# EAGLE schematic mcat-4cu-b-v2d (EAGLE 6.5.0)

## Sheet 1 of 5
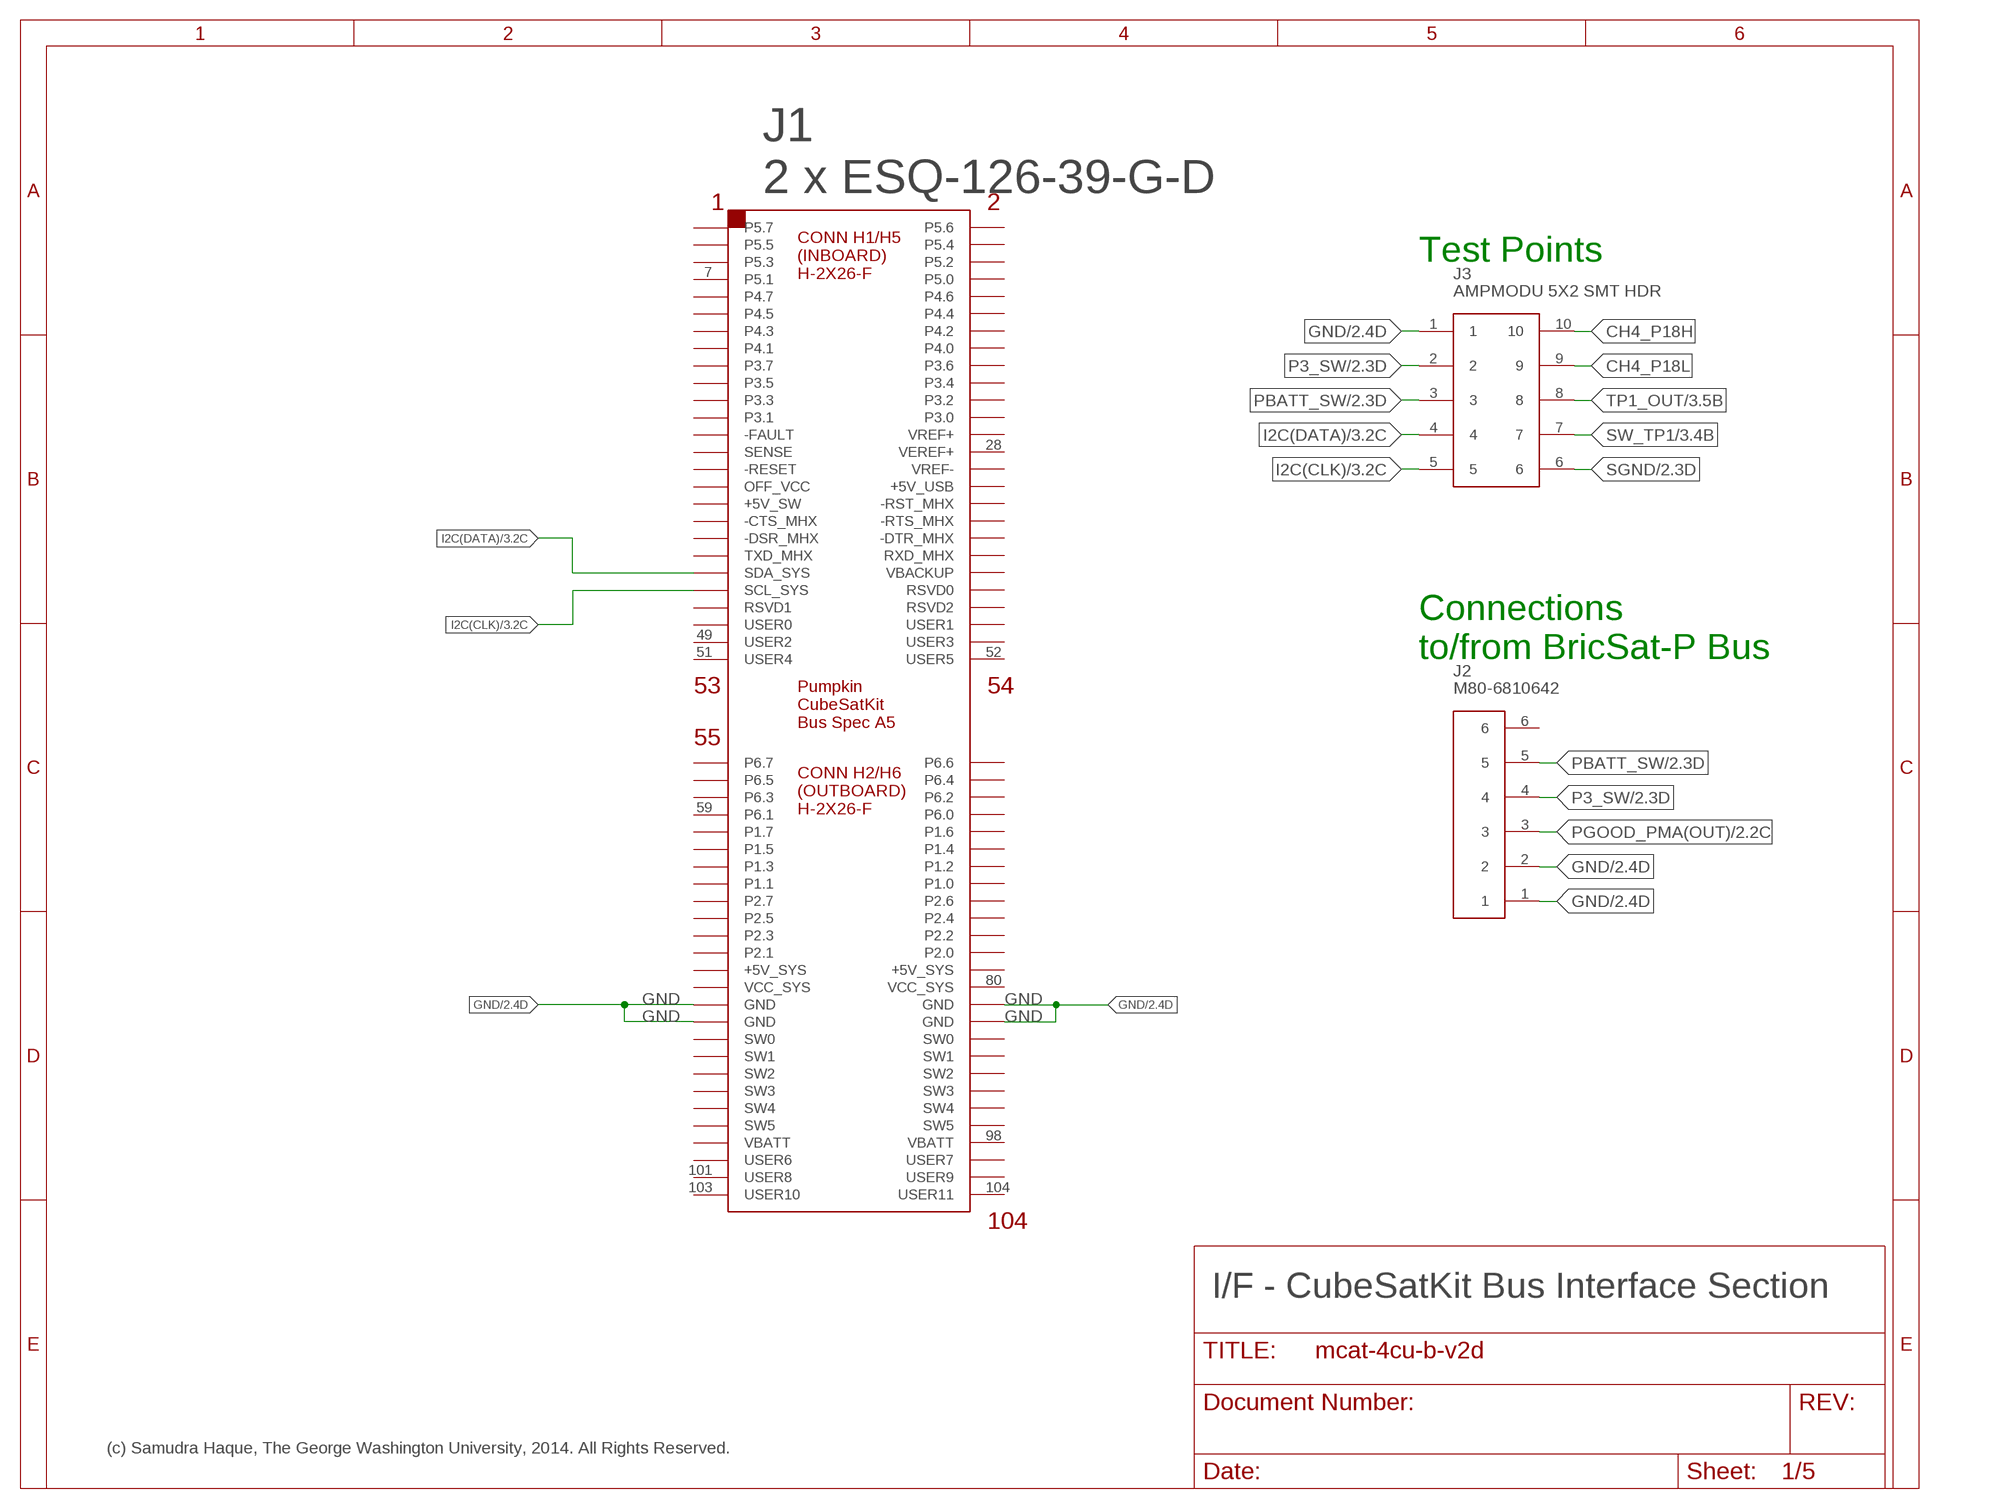
[diagram p0: schematic, sheet 1]

### Parts
J1  2 x ESQ-126-39-G-D  CSK-BUS-CONN2X2X26  [CSK-BUS-PKG]
J2  M80-6810642  [M80-68106]
J3  AMPMODU 5X2 SMT HDR  AMPMODU-5-146131-X(5X2)  [AMPMODU-SMT-PIN-HEADER-5X2]

### Nets
CH4_P18H [vout1a2ozcu]: J3.10 ; also sheet 5
CH4_P18L: J3.9 ; also sheet 5
GND: J1.81(GND) J1.82(GND) J1.83(GND) J1.84(GND) J2.1 J2.2 J3.1 ; also sheet 2,3
I2C(CLK): J1.43(SCL_SYS) J3.5 ; also sheet 3
I2C(DATA): J1.41(SDA_SYS) J3.4 ; also sheet 3
P3_SW: J2.4 J3.2 ; also sheet 2
PBATT_SW [vin2a2ozcu]: J2.5 J3.3 ; also sheet 2
PGOOD_PMA(OUT): J2.3 ; also sheet 2
SGND: J3.6 ; also sheet 2,3,4,5
SW_TP1: J3.7 ; also sheet 3
TP1_OUT: J3.8 ; also sheet 3,5
Unconnected: J1.1(P5.7) J1.2(P5.6) J1.3(P5.5) J1.4(P5.4) J1.5(P5.3) J1.6(P5.2) J1.7(P5.1) J1.8(P5.0) J1.9(P4.7) J1.10(P4.6) J1.11(P4.5) J1.12(P4.4) J1.13(P4.3) J1.14(P4.2) J1.15(P4.1) J1.16(P4.0) J1.17(P3.7) J1.18(P3.6) J1.19(P3.5) J1.20(P3.4) J1.21(P3.3) J1.22(P3.2) J1.23(P3.1) J1.24(P3.0) J1.25(-FAULT) J1.26(VREF+) J1.27(SENSE) J1.28(VEREF+) J1.29(-RESET) J1.30(VREF-) J1.31(OFF_VCC) J1.32(+5V_USB) J1.33(+5V_SW) J1.34(-RST_MHX) J1.35(-CTS_MHX) J1.36(-RTS_MHX) J1.37(-DSR_MHX) J1.38(-DTR_MHX) J1.39(TXD_MHX) J1.40(RXD_MHX) J1.42(VBACKUP) J1.44(RSVD0) J1.45(RSVD1) J1.46(RSVD2) J1.47(USER0) J1.48(USER1) J1.49(USER2) J1.50(USER3) J1.51(USER4) J1.52(USER5) J1.53(P6.7) J1.54(P6.6) J1.55(P6.5) J1.56(P6.4) J1.57(P6.3) J1.58(P6.2) J1.59(P6.1) J1.60(P6.0) J1.61(P1.7) J1.62(P1.6) J1.63(P1.5) J1.64(P1.4) J1.65(P1.3) J1.66(P1.2) J1.67(P1.1) J1.68(P1.0) J1.69(P2.7) J1.70(P2.6) J1.71(P2.5) J1.72(P2.4) J1.73(P2.3) J1.74(P2.2) J1.75(P2.1) J1.76(P2.0) J1.77(+5V_SYS) J1.78(+5V_SYS) J1.79(VCC_SYS) J1.80(VCC_SYS) J1.85(SW0) J1.86(SW0) J1.87(SW1) J1.88(SW1) J1.89(SW2) J1.90(SW2) J1.91(SW3) J1.92(SW3) J1.93(SW4) J1.94(SW4) J1.95(SW5) J1.96(SW5) J1.97(VBATT) J1.98(VBATT) J1.99(USER6) J1.100(USER7) J1.101(USER8) J1.102(USER9) J1.103(USER10) J1.104(USER11) J2.6

### Notes on the sheet
- Test Points
- Connections
  to/from BricSat-P Bus
- I/F - CubeSatKit Bus Interface Section
- (c) Samudra Haque, The George Washington University, 2014. All Rights Reserved.

## Sheet 2 of 5
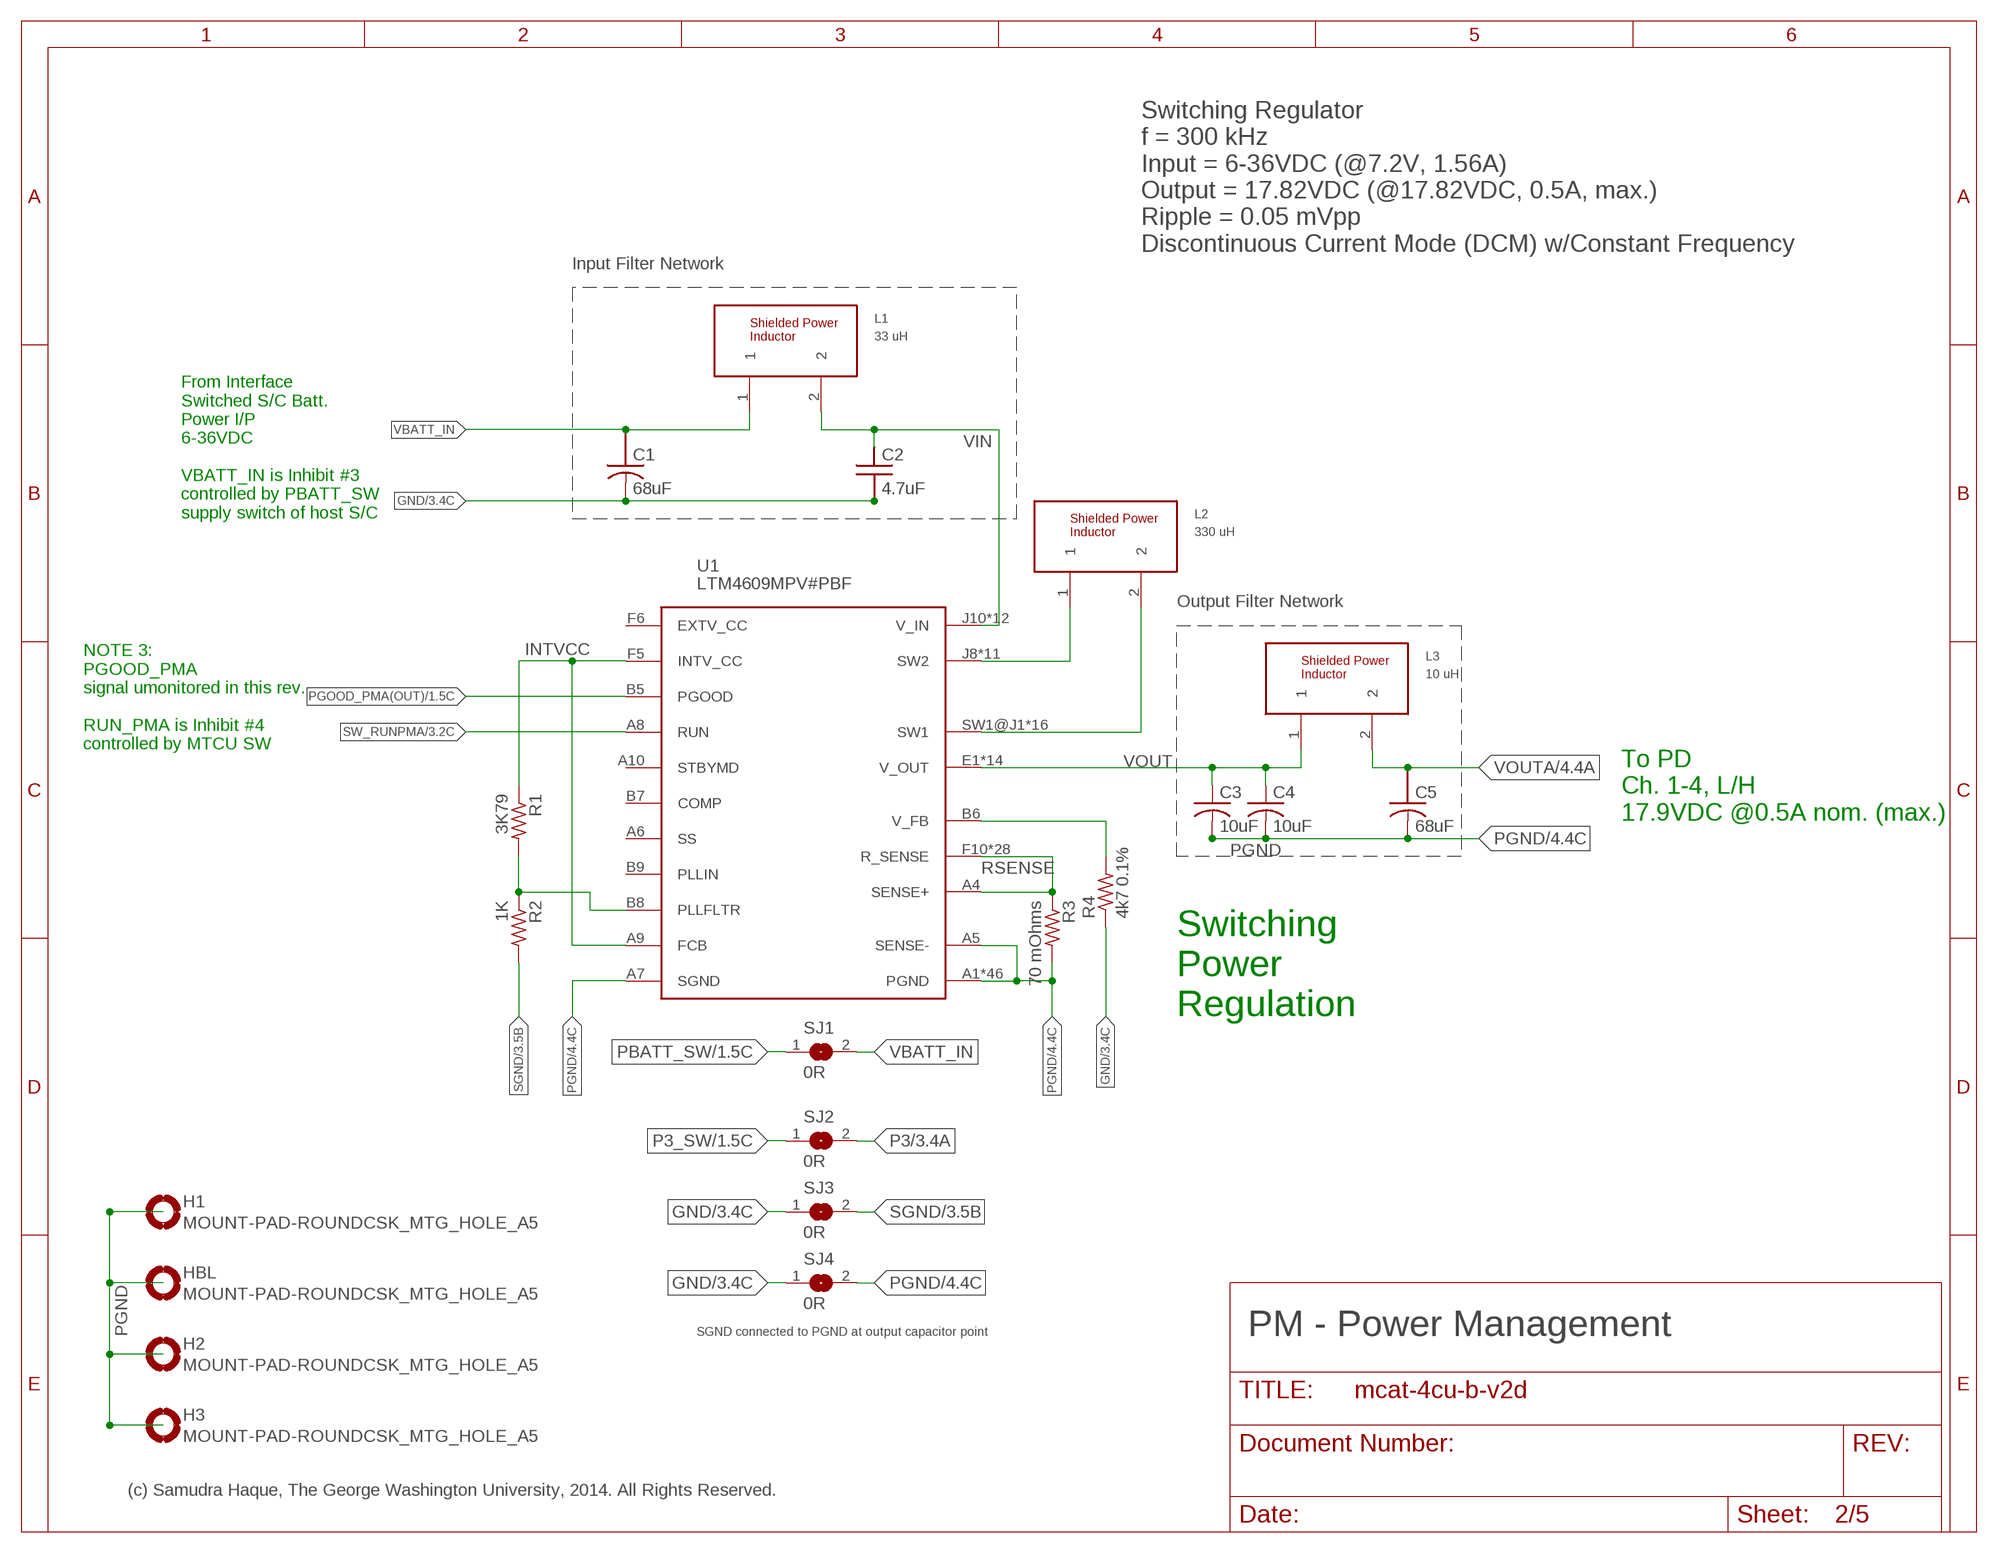
[diagram p1: schematic, sheet 2]

### Parts
C1  68uF  OSCON-50SVPF68M  [OS-CON-SVPF-F12]
C2  4.7uF  AVX-LD105C475KAB2A  [MLCC-X7R-1210]
C3  10uF  C-USC1210K  [C1210K]
C4  10uF  C-USC1210K  [C1210K]
C5  68uF  OSCON-50SVPF68M  [OS-CON-SVPF-F12]
H1  MOUNT-PAD-ROUNDCSK_MTG_HOLE_A5  [CSK_MOUNTING_HOLE]
H2  MOUNT-PAD-ROUNDCSK_MTG_HOLE_A5  [CSK_MOUNTING_HOLE]
H3  MOUNT-PAD-ROUNDCSK_MTG_HOLE_A5  [CSK_MOUNTING_HOLE]
HBL  MOUNT-PAD-ROUNDCSK_MTG_HOLE_A5  [CSK_MOUNTING_HOLE]
L1  33 uH  MSS1038-333ML_  [MSS1048]
L2  330 uH  MSS1048-334KL_  [MSS1048]
L3  10 uH  ELL-5PS100M  [SERIES-POWER-INDUCTORS]
R1  3K79  R-US_R0805  [R0805]
R2  1K  R-US_R0805  [R0805]
R3  70 mOhms  R-US_R1206  [R1206]
R4  4k7 0.1%  R-US_R0603  [R0603]
SJ1  0R  SJ  [SJ]
SJ2  0R  SJ  [SJ]
SJ3  0R  SJ  [SJ]
SJ4  0R  SJ  [SJ]
U1  LTM4609MPV#PBF  LTM4609MPV#PBFROHS/HITEMP  [LGA-141-LTC-05-08-1840-B]

### Nets
GND: C1.K1(K) C2.2 R4.1 SJ3.1 SJ4.1 ; also sheet 1,3
INTVCC: R1.1 U1.A9(FCB) U1.F5(INTV_CC) ; also sheet 3
P3: SJ2.2 ; also sheet 3
P3_SW: SJ2.1 ; also sheet 1
PBATT_SW [vin2a2ozcu]: SJ1.1 ; also sheet 1
PGND: C3.2 C4.2 C5.K1(K) H1.P$1(MOUNT) H2.P$1(MOUNT) H3.P$1(MOUNT) HBL.P$1(MOUNT) R3.2 SJ4.2 U1.A1(PGND) U1.A2(PGND) U1.A3(PGND) U1.A5(SENSE-) U1.A7(SGND) U1.A11(PGND) U1.A12(PGND) U1.B1(PGND) U1.B2(PGND) U1.B3(PGND) U1.B4(PGND) U1.B10(PGND) U1.B11(PGND) U1.B12(PGND) U1.C1(PGND) U1.C2(PGND) U1.C3(PGND) U1.C4(PGND) U1.C5(PGND) U1.C6(PGND) U1.C7(PGND) U1.C8(PGND) U1.C9(PGND) U1.C10(PGND) U1.C11(PGND) U1.C12(PGND) U1.D1(PGND) U1.D2(PGND) U1.D3(PGND) U1.D4(PGND) U1.D5(PGND) U1.D6(PGND) U1.D7(PGND) U1.D8(PGND) U1.D9(PGND) U1.D10(PGND) U1.D11(PGND) U1.D12(PGND) U1.E3(PGND) U1.E4(PGND) U1.E5(PGND) U1.E6(PGND) U1.E7(PGND) U1.E8(PGND) U1.E9(PGND) U1.E10(PGND) U1.E11(PGND) U1.E12(PGND) ; also sheet 4,5
PGOOD_PMA(OUT): U1.B5(PGOOD) ; also sheet 1
RSENSE: R3.1 U1.A4(SENSE+) U1.F10(R_SENSE) U1.F11(R_SENSE) U1.F12(R_SENSE) U1.G5(R_SENSE) U1.G6(R_SENSE) U1.G7(R_SENSE) U1.G8(R_SENSE) U1.G9(R_SENSE) U1.G10(R_SENSE) U1.G11(R_SENSE) U1.G12(R_SENSE) U1.H5(R_SENSE) U1.H6(R_SENSE) U1.H7(R_SENSE) U1.H8(R_SENSE) U1.H9(R_SENSE) U1.H10(R_SENSE) U1.H11(R_SENSE) U1.H12(R_SENSE) U1.J5(R_SENSE) U1.J6(R_SENSE) U1.J7(R_SENSE) U1.K5(R_SENSE) U1.K6(R_SENSE) U1.L5(R_SENSE) U1.L6(R_SENSE) U1.M5(R_SENSE) U1.M6(R_SENSE)
SETFREQ: R1.2 R2.1 U1.B8(PLLFLTR)
SGND: R2.2 SJ3.2 ; also sheet 1,3,4,5
SW1: L2.2 U1.SW1@J1(SW1) U1.SW1@J2(SW1) U1.SW1@J3(SW1) U1.SW1@J4(SW1) U1.SW1@K1(SW1) U1.SW1@K2(SW1) U1.SW1@K3(SW1) U1.SW1@K4(SW1) U1.SW1@L1(SW1) U1.SW1@L2(SW1) U1.SW1@L3(SW1) U1.SW1@L4(SW1) U1.SW1@M1(SW1) U1.SW1@M2(SW1) U1.SW1@M3(SW1) U1.SW1@M4(SW1)
SW2: L2.1 U1.J8(SW2) U1.J9(SW2) U1.K7(SW2) U1.K8(SW2) U1.K9(SW2) U1.L7(SW2) U1.L8(SW2) U1.L9(SW2) U1.M7(SW2) U1.M8(SW2) U1.M9(SW2)
SW_RUNPMA: U1.A8(RUN) ; also sheet 3
VBATT_IN [vin2a2ozcu]: C1.A1(A) L1.1 SJ1.2
VFB: R4.2 U1.B6(V_FB)
VIN: C2.1 L1.2 U1.J10(V_IN) U1.J11(V_IN) U1.J12(V_IN) U1.K10(V_IN) U1.K11(V_IN) U1.K12(V_IN) U1.L10(V_IN) U1.L11(V_IN) U1.L12(V_IN) U1.M10(V_IN) U1.M11(V_IN) U1.M12(V_IN)
VOUT [vout1a2ozcu]: C3.1 C4.1 L3.1 U1.E1(V_OUT) U1.E2(V_OUT) U1.F1(V_OUT) U1.F2(V_OUT) U1.F3(V_OUT) U1.F4(V_OUT) U1.G1(V_OUT) U1.G2(V_OUT) U1.G3(V_OUT) U1.G4(V_OUT) U1.H2(V_OUT) U1.H3(V_OUT) U1.H4(V_OUT) U1.VOUT(V_OUT)
VOUTA [vout1a2ozcu]: C5.A1(A) L3.2 ; also sheet 4,5
Unconnected: U1.A6(SS) U1.A10(STBYMD) U1.B7(COMP) U1.B9(PLLIN) U1.F6(EXTV_CC)

### Notes on the sheet
- Switching Regulator
  f = 300 kHz
  Input = 6-36VDC (@7.2V, 1.56A)
  Output = 17.82VDC (@17.82VDC, 0.5A, max.)
  Ripple = 0.05 mVpp
  Discontinuous Current Mode (DCM) w/Constant Frequency
- Input Filter Network
- From Interface
  Switched S/C Batt. 
  Power I/P
  6-36VDC
  
  VBATT_IN is Inhibit #3
  controlled by PBATT_SW
  supply switch of host S/C
- Output Filter Network
- NOTE 3:
  PGOOD_PMA
  signal umonitored in this rev.
  
  RUN_PMA is Inhibit #4
  controlled by MTCU SW
- To PD
  Ch. 1-4, L/H
  17.9VDC @0.5A nom. (max.)
- Switching 
  Power 
  Regulation
- SGND connected to PGND at output capacitor point | PM - Power Management
- (c) Samudra Haque, The George Washington University, 2014. All Rights Reserved.

## Sheet 3 of 5
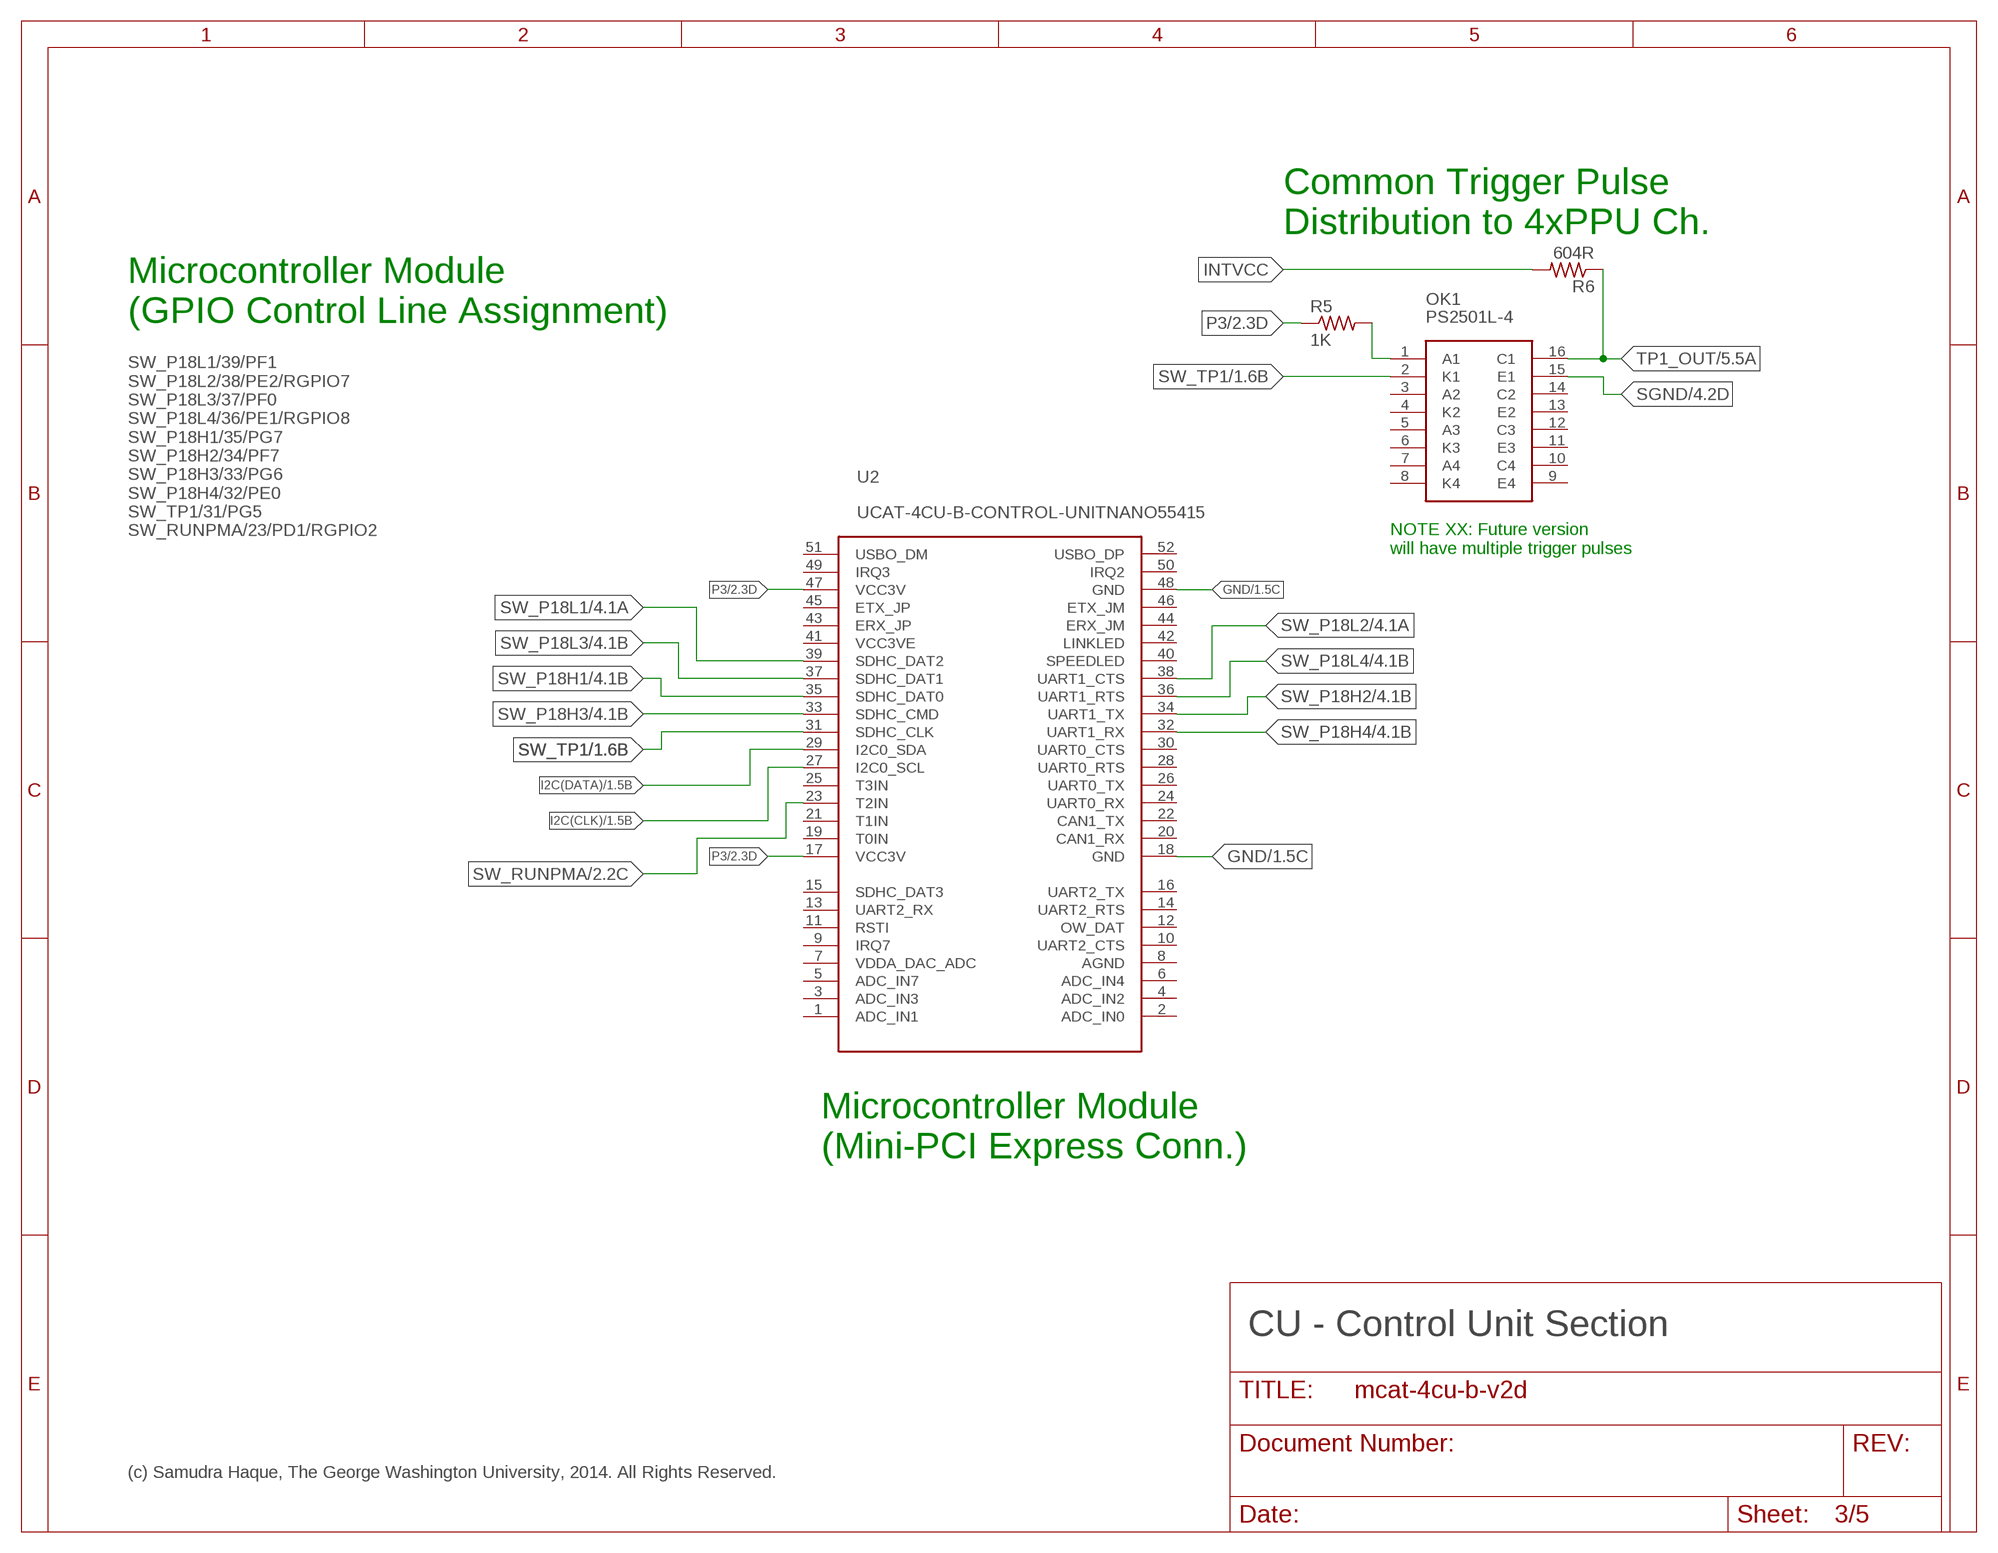
[diagram p2: schematic, sheet 3]

### Parts
OK1  PS2501L-4  [PS2501L-4]
R5  1K  R-US_R0805  [R0805]
R6  604R  R-US_R0805  [R0805]
U2  UCAT-4CU-B-CONTROL-UNITNANO55415  [MOLEX-MINI-PCI-EXPRESS-8MM-52CKT]

### Nets
GND: U2.18(GND) U2.48(GND) ; also sheet 1,2
I2C(CLK): U2.27(I2C0_SCL) ; also sheet 1
I2C(DATA): U2.29(I2C0_SDA) ; also sheet 1
INTVCC: R6.2 ; also sheet 2
N$16: OK1.1(A1) R5.2
P3: R5.1 U2.17(VCC3V) U2.47(VCC3V) ; also sheet 2
SGND: OK1.15(E1) ; also sheet 1,2,4,5
SW_P18H1: U2.35(SDHC_DAT0) ; also sheet 4
SW_P18H2: U2.34(UART1_TX) ; also sheet 4
SW_P18H3: U2.33(SDHC_CMD) ; also sheet 4
SW_P18H4: U2.32(UART1_RX) ; also sheet 4
SW_P18L1: U2.39(SDHC_DAT2) ; also sheet 4
SW_P18L2: U2.38(UART1_CTS) ; also sheet 4
SW_P18L3: U2.37(SDHC_DAT1) ; also sheet 4
SW_P18L4: U2.36(UART1_RTS) ; also sheet 4
SW_RUNPMA: U2.23(T2IN) ; also sheet 2
SW_TP1: OK1.2(K1) U2.31(SDHC_CLK) ; also sheet 1
TP1_OUT: OK1.16(C1) R6.1 ; also sheet 1,5
Unconnected: OK1.3(A2) OK1.4(K2) OK1.5(A3) OK1.6(K3) OK1.7(A4) OK1.8(K4) OK1.9(E4) OK1.10(C4) OK1.11(E3) OK1.12(C3) OK1.13(E2) OK1.14(C2) U2.1(ADC_IN1) U2.2(ADC_IN0) U2.3(ADC_IN3) U2.4(ADC_IN2) U2.5(ADC_IN7) U2.6(ADC_IN4) U2.7(VDDA_DAC_ADC) U2.8(AGND) U2.9(IRQ7) U2.10(UART2_CTS) U2.11(RSTI) U2.12(OW_DAT) U2.13(UART2_RX) U2.14(UART2_RTS) U2.15(SDHC_DAT3) U2.16(UART2_TX) U2.19(T0IN) U2.20(CAN1_RX) U2.21(T1IN) U2.22(CAN1_TX) U2.24(UART0_RX) U2.25(T3IN) U2.26(UART0_TX) U2.28(UART0_RTS) U2.30(UART0_CTS) U2.40(SPEEDLED) U2.41(VCC3VE) U2.42(LINKLED) U2.43(ERX_JP) U2.44(ERX_JM) U2.45(ETX_JP) U2.46(ETX_JM) U2.49(IRQ3) U2.50(IRQ2) U2.51(USBO_DM) U2.52(USBO_DP)

### Notes on the sheet
- Common Trigger Pulse
  Distribution to 4xPPU Ch.
- Microcontroller Module
  (GPIO Control Line Assignment)
- SW_P18L1/39/PF1
  SW_P18L2/38/PE2/RGPIO7
  SW_P18L3/37/PF0
  SW_P18L4/36/PE1/RGPIO8
  SW_P18H1/35/PG7
  SW_P18H2/34/PF7
  SW_P18H3/33/PG6
  SW_P18H4/32/PE0
  SW_TP1/31/PG5
  SW_RUNPMA/23/PD1/RGPIO2
- NOTE XX: Future version
  will have multiple trigger pulses
- Microcontroller Module
  (Mini-PCI Express Conn.)
- CU - Control Unit Section
- (c) Samudra Haque, The George Washington University, 2014. All Rights Reserved.

## Sheet 4 of 5
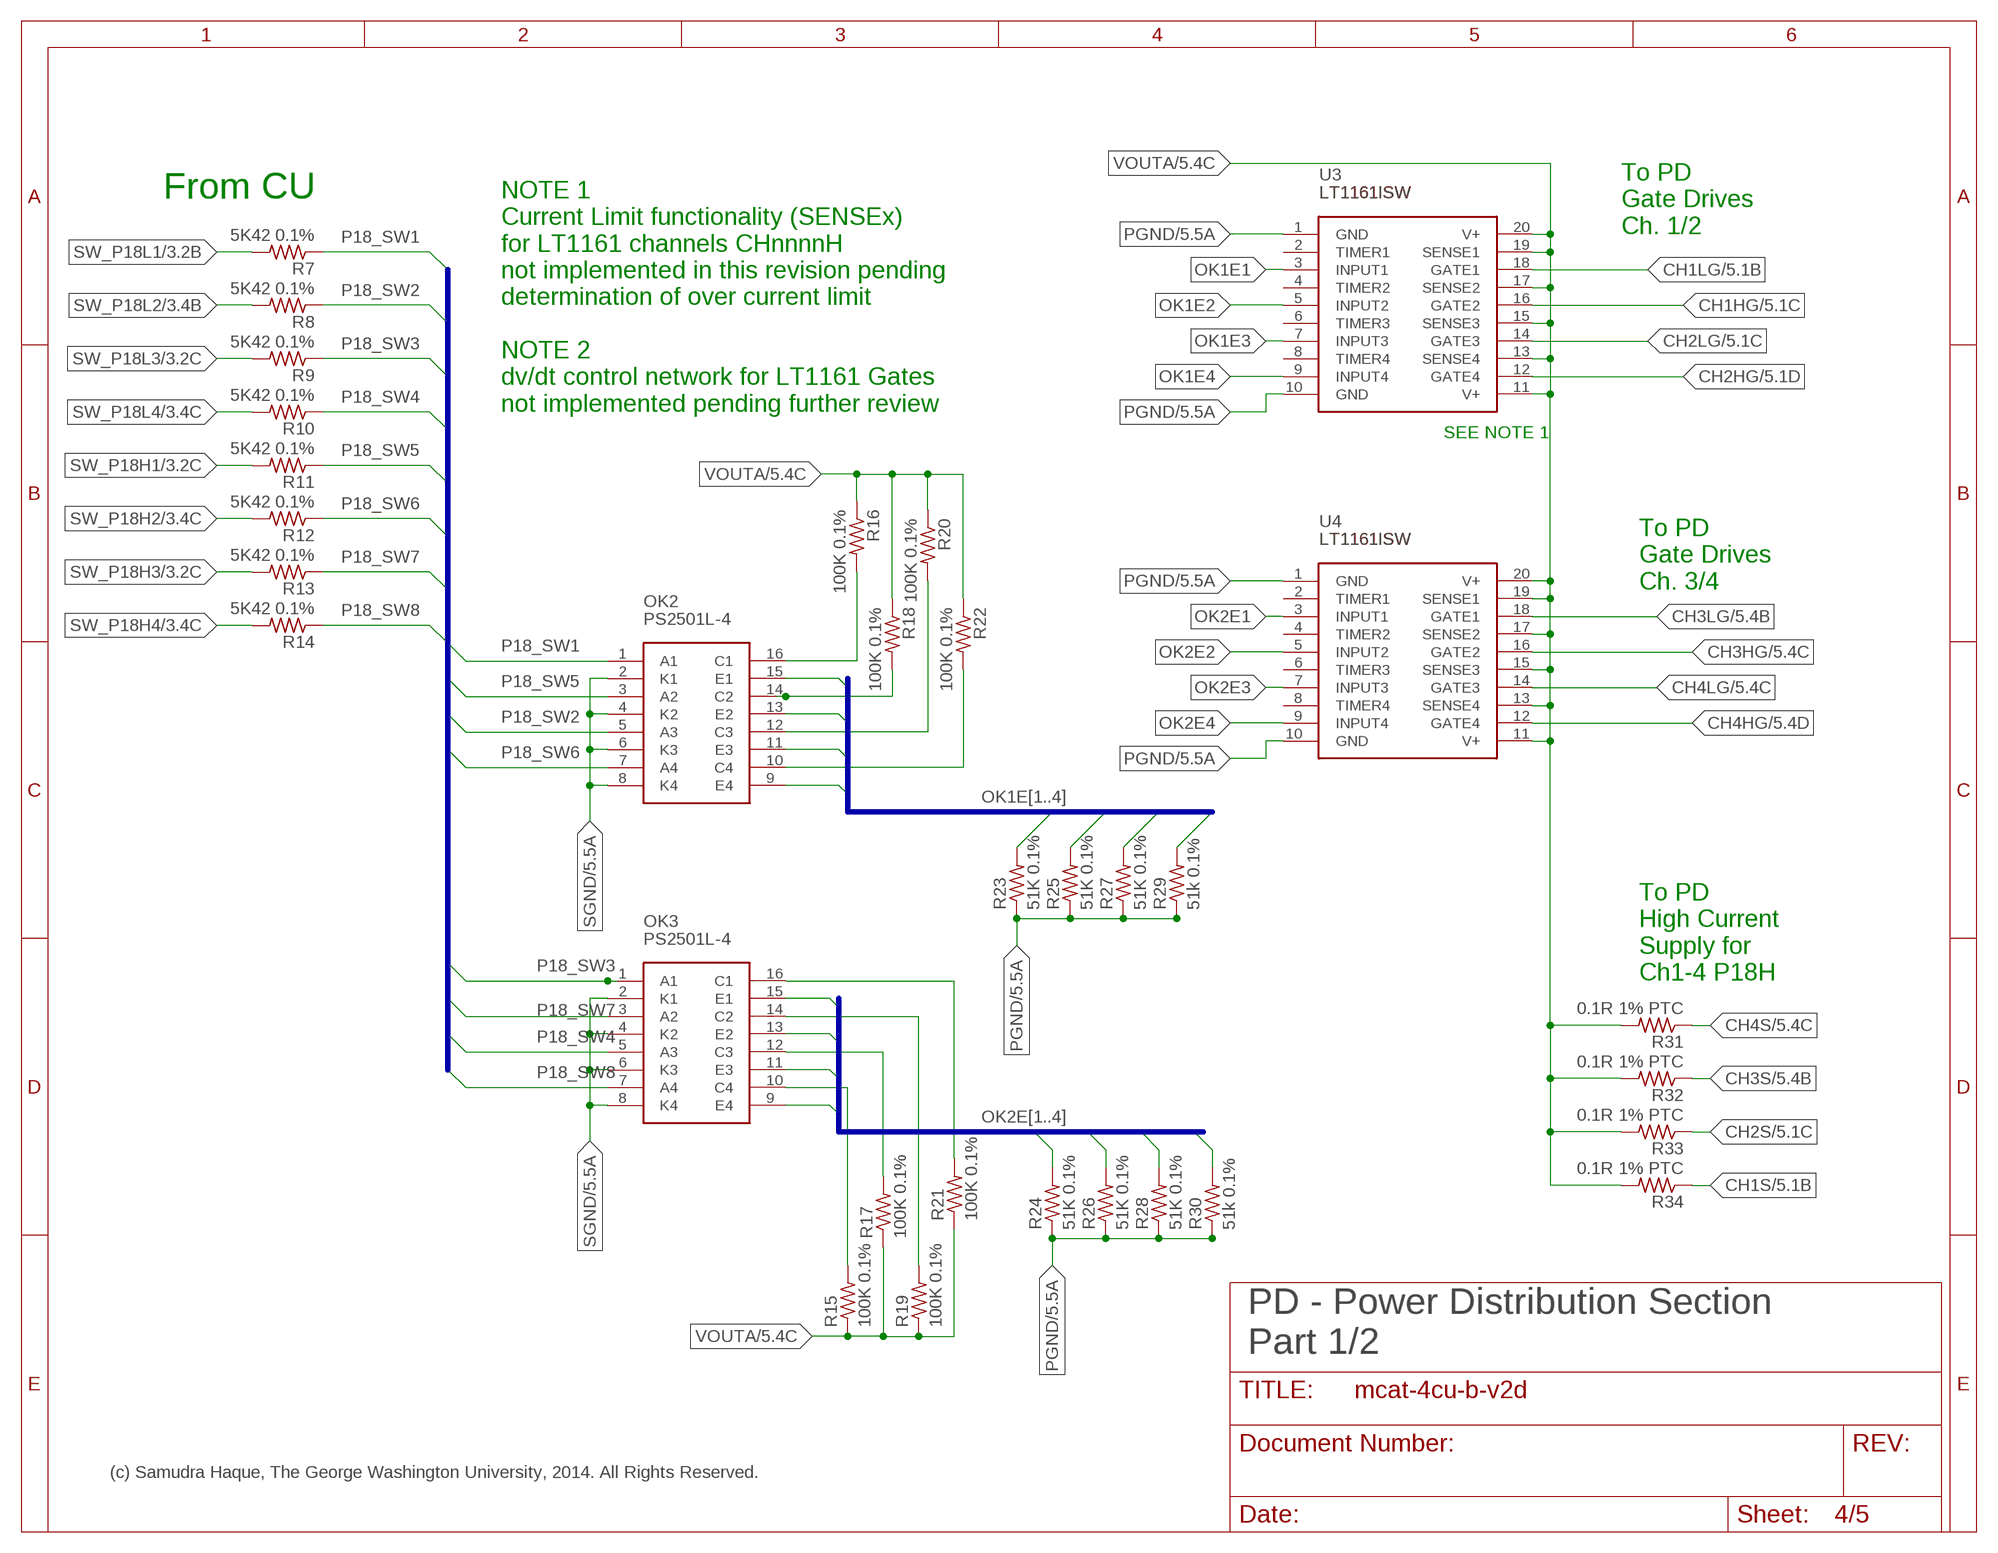
[diagram p3: schematic, sheet 4]

### Parts
OK2  PS2501L-4  [PS2501L-4]
OK3  PS2501L-4  [PS2501L-4]
R7  5K42 0.1%  R-US_R1206  [R1206]
R8  5K42 0.1%  R-US_R1206  [R1206]
R9  5K42 0.1%  R-US_R1206  [R1206]
R10  5K42 0.1%  R-US_R1206  [R1206]
R11  5K42 0.1%  R-US_R1206  [R1206]
R12  5K42 0.1%  R-US_R1206  [R1206]
R13  5K42 0.1%  R-US_R1206  [R1206]
R14  5K42 0.1%  R-US_R1206  [R1206]
R15  100K 0.1%  R-US_R0402  [R0402]
R16  100K 0.1%  R-US_R0402  [R0402]
R17  100K 0.1%  R-US_R0402  [R0402]
R18  100K 0.1%  R-US_R0402  [R0402]
R19  100K 0.1%  R-US_R0402  [R0402]
R20  100K 0.1%  R-US_R0402  [R0402]
R21  100K 0.1%  R-US_R0402  [R0402]
R22  100K 0.1%  R-US_R0402  [R0402]
R23  51K 0.1%  R-US_R0603  [R0603]
R24  51K 0.1%  R-US_R0603  [R0603]
R25  51K 0.1%  R-US_R0603  [R0603]
R26  51K 0.1%  R-US_R0603  [R0603]
R27  51K 0.1%  R-US_R0603  [R0603]
R28  51K 0.1%  R-US_R0603  [R0603]
R29  51k 0.1%  R-US_R0603  [R0603]
R30  51k 0.1%  R-US_R0603  [R0603]
R31  0.1R 1% PTC  R-US_R0402  [R0402]
R32  0.1R 1% PTC  R-US_R0402  [R0402]
R33  0.1R 1% PTC  R-US_R0402  [R0402]
R34  0.1R 1% PTC  R-US_R0402  [R0402]
U3  LT1161ISW  [20-LEAD-PLASTIC-SO]
U4  LT1161ISW  [20-LEAD-PLASTIC-SO]

### Nets
CH1HG: U3.16(GATE2) ; also sheet 5
CH1LG: U3.18(GATE1) ; also sheet 5
CH1S: R34.1 ; also sheet 5
CH2HG: U3.12(GATE4) ; also sheet 5
CH2LG: U3.14(GATE3) ; also sheet 5
CH2S: R33.1 ; also sheet 5
CH3HG: U4.16(GATE2) ; also sheet 5
CH3LG: U4.18(GATE1) ; also sheet 5
CH3S: R32.1 ; also sheet 5
CH4HG: U4.12(GATE4) ; also sheet 5
CH4LG: U4.14(GATE3) ; also sheet 5
CH4S: R31.1 ; also sheet 5
N$4: OK2.16(C1) R16.2
N$5: OK2.14(C2) R18.2
N$7: OK2.12(C3) R20.2
N$9: OK2.10(C4) R22.2
N$10: OK3.16(C1) R21.2
N$11: OK3.14(C2) R19.2
N$12: OK3.12(C3) R17.2
N$13: OK3.10(C4) R15.2
OK1E1: OK2.15(E1) R23.2 U3.3(INPUT1)
OK1E2: OK2.13(E2) R25.2 U3.5(INPUT2)
OK1E3: OK2.11(E3) R27.2 U3.7(INPUT3)
OK1E4: OK2.9(E4) R29.2 U3.9(INPUT4)
OK2E1: OK3.15(E1) R24.2 U4.3(INPUT1)
OK2E2: OK3.13(E2) R26.2 U4.5(INPUT2)
OK2E3: OK3.11(E3) R28.2 U4.7(INPUT3)
OK2E4: OK3.9(E4) R30.2 U4.9(INPUT4)
P18_SW1: OK2.1(A1) R7.1
P18_SW2: OK2.5(A3) R8.1
P18_SW3: OK3.1(A1) R9.1
P18_SW4: OK3.5(A3) R10.1
P18_SW5: OK2.3(A2) R11.1
P18_SW6: OK2.7(A4) R12.1
P18_SW7: OK3.3(A2) R13.1
P18_SW8: OK3.7(A4) R14.1
PGND: R23.1 R24.1 R25.1 R26.1 R27.1 R28.1 R29.1 R30.1 U3.1(GND) U3.10(GND) U4.1(GND) U4.10(GND) ; also sheet 2,5
SGND: OK2.2(K1) OK2.4(K2) OK2.6(K3) OK2.8(K4) OK3.2(K1) OK3.4(K2) OK3.6(K3) OK3.8(K4) ; also sheet 1,2,3,5
SW_P18H1: R11.2 ; also sheet 3
SW_P18H2: R12.2 ; also sheet 3
SW_P18H3: R13.2 ; also sheet 3
SW_P18H4: R14.2 ; also sheet 3
SW_P18L1: R7.2 ; also sheet 3
SW_P18L2: R8.2 ; also sheet 3
SW_P18L3: R9.2 ; also sheet 3
SW_P18L4: R10.2 ; also sheet 3
VOUTA [vout1a2ozcu]: R15.1 R16.1 R17.1 R18.1 R19.1 R20.1 R21.1 R22.1 R31.2 R32.2 R33.2 R34.2 U3.11(V+) U3.13(SENSE4) U3.15(SENSE3) U3.17(SENSE2) U3.19(SENSE1) U3.20(V+) U4.11(V+) U4.13(SENSE4) U4.15(SENSE3) U4.17(SENSE2) U4.19(SENSE1) U4.20(V+) ; also sheet 2,5
Unconnected: U3.2(TIMER1) U3.4(TIMER2) U3.6(TIMER3) U3.8(TIMER4) U4.2(TIMER1) U4.4(TIMER2) U4.6(TIMER3) U4.8(TIMER4)

### Buses
P18_SW[1..8]
OK1E[1..4]
OK2E[1..4]

### Notes on the sheet
- From CU
- To PD
  Gate Drives
  Ch. 1/2
- NOTE 1 
  Current Limit functionality (SENSEx)
  for LT1161 channels CHnnnnH
  not implemented in this revision pending
  determination of over current limit
  
  NOTE 2
  dv/dt control network for LT1161 Gates
  not implemented pending further review
- SEE NOTE 1
- To PD
  Gate Drives
  Ch. 3/4
- To PD
  High Current
  Supply for
  Ch1-4 P18H
- PD - Power Distribution Section
  Part 1/2
- (c) Samudra Haque, The George Washington University, 2014. All Rights Reserved.

## Sheet 5 of 5
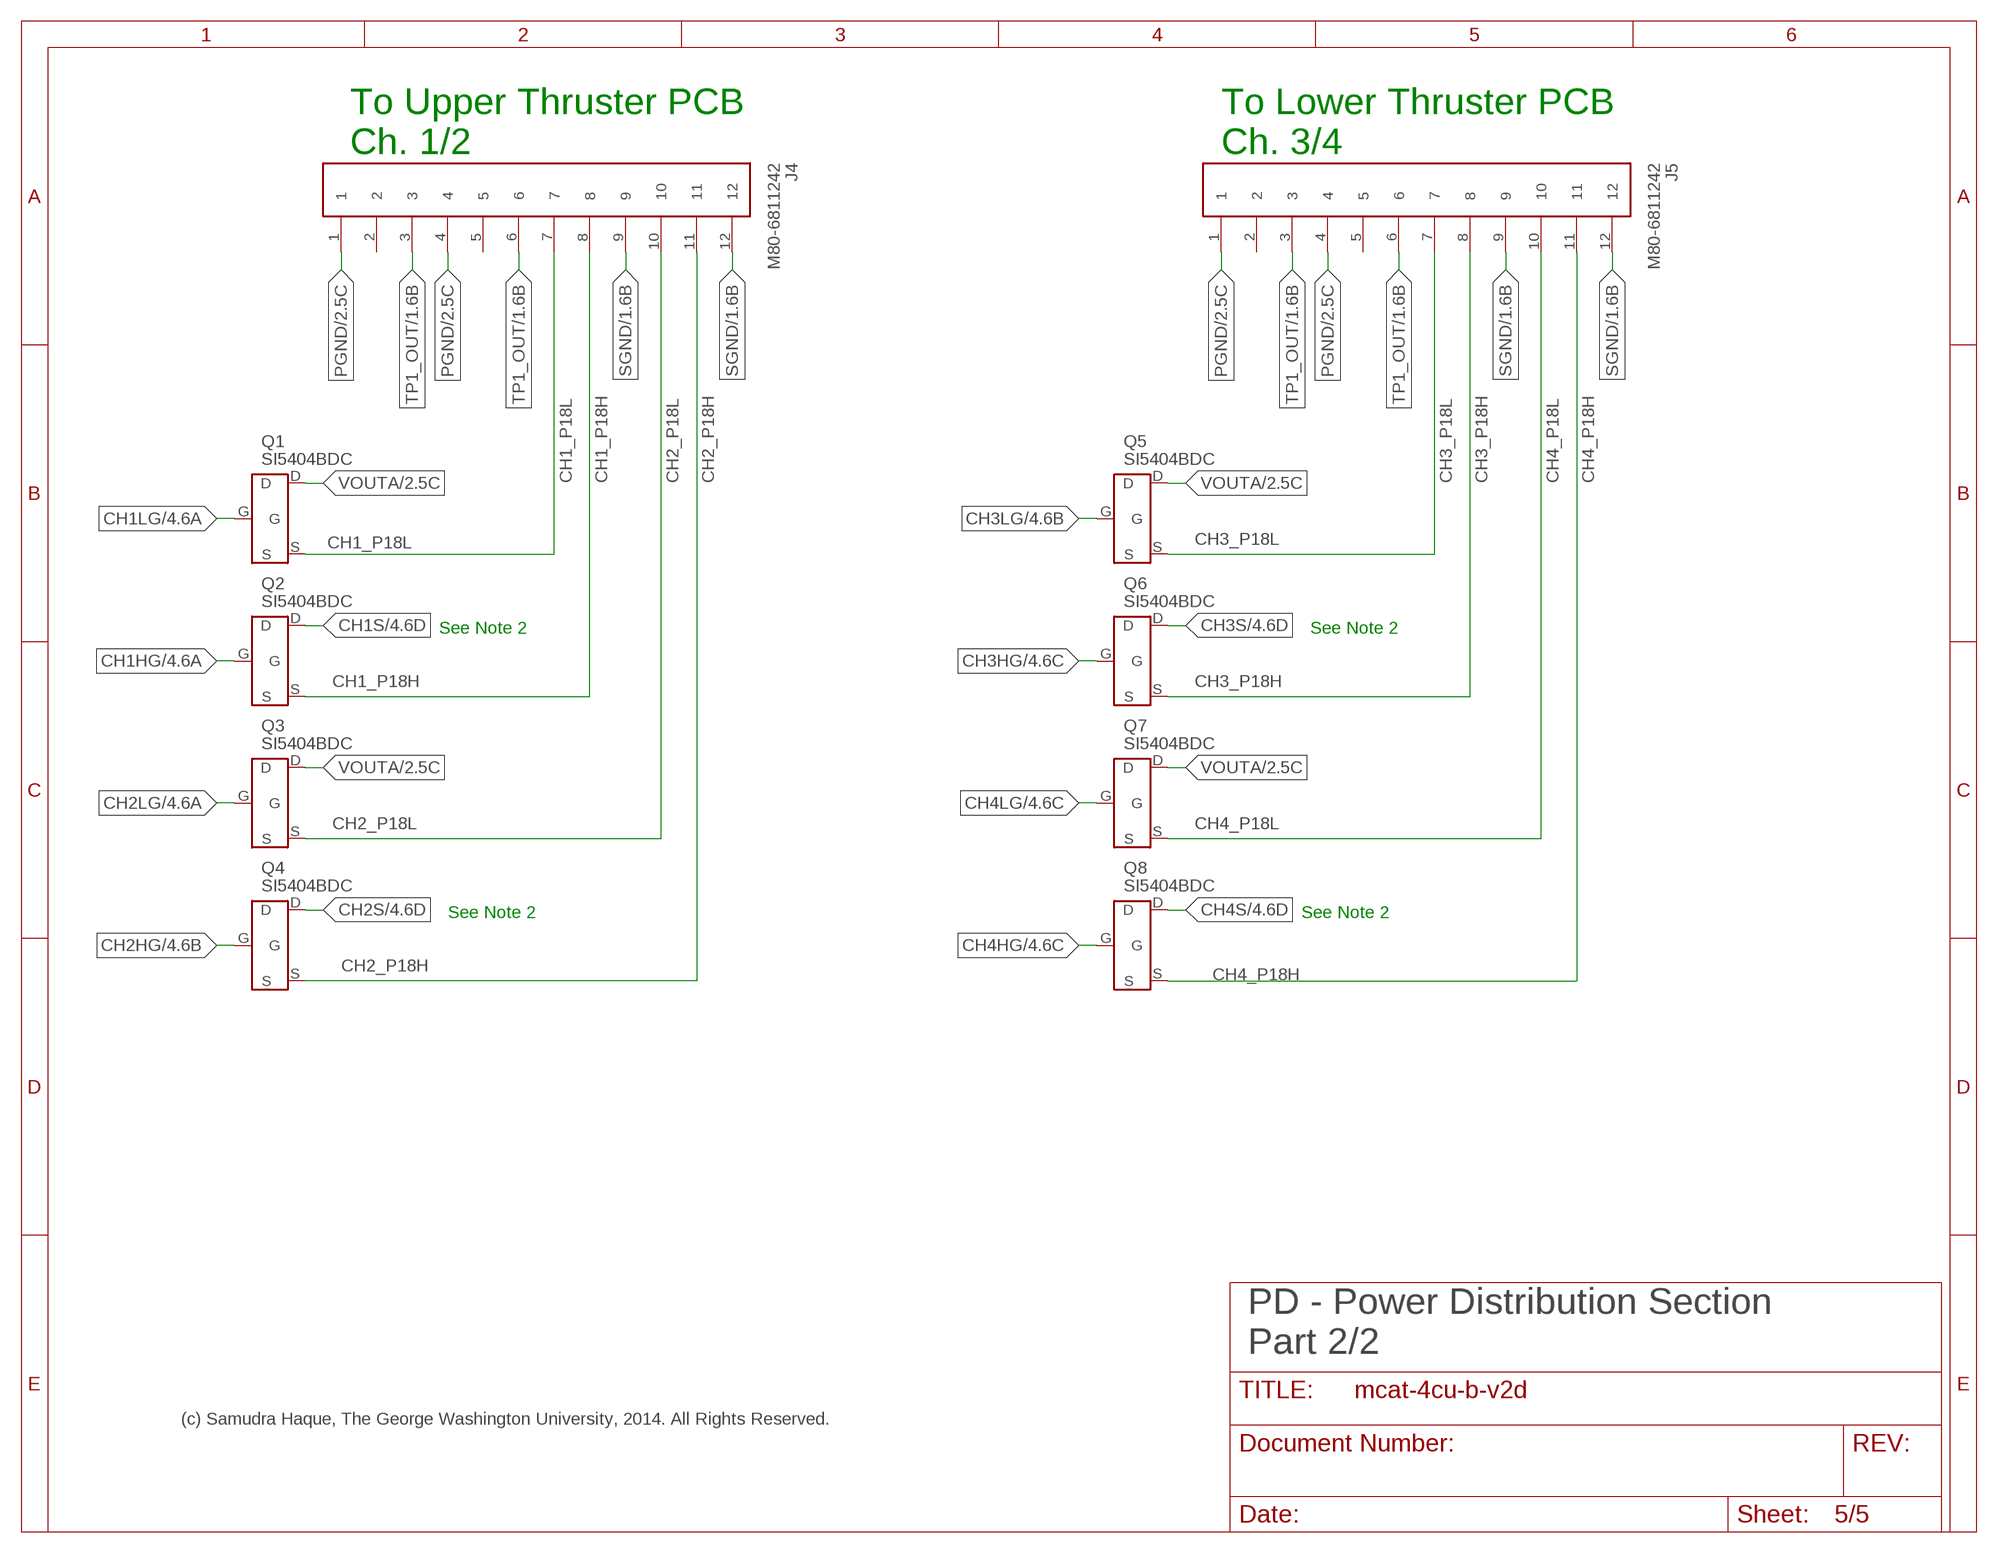
[diagram p4: schematic, sheet 5]

### Parts
J4  M80-6811242  [M80-68112]
J5  M80-6811242  [M80-68112]
Q1  SI5404BDC  [1206-8-CHIPFET]
Q2  SI5404BDC  [1206-8-CHIPFET]
Q3  SI5404BDC  [1206-8-CHIPFET]
Q4  SI5404BDC  [1206-8-CHIPFET]
Q5  SI5404BDC  [1206-8-CHIPFET]
Q6  SI5404BDC  [1206-8-CHIPFET]
Q7  SI5404BDC  [1206-8-CHIPFET]
Q8  SI5404BDC  [1206-8-CHIPFET]

### Nets
CH1_P18H [vout1a2ozcu]: J4.8 Q2.S
CH1_P18L: J4.7 Q1.S
CH1HG: Q2.G ; also sheet 4
CH1LG: Q1.G ; also sheet 4
CH1S: Q2.D ; also sheet 4
CH2_P18H [vout1a2ozcu]: J4.11 Q4.S
CH2_P18L: J4.10 Q3.S
CH2HG: Q4.G ; also sheet 4
CH2LG: Q3.G ; also sheet 4
CH2S: Q4.D ; also sheet 4
CH3_P18H [vout1a2ozcu]: J5.8 Q6.S
CH3_P18L: J5.7 Q5.S
CH3HG: Q6.G ; also sheet 4
CH3LG: Q5.G ; also sheet 4
CH3S: Q6.D ; also sheet 4
CH4_P18H [vout1a2ozcu]: J5.11 Q8.S ; also sheet 1
CH4_P18L: J5.10 Q7.S ; also sheet 1
CH4HG: Q8.G ; also sheet 4
CH4LG: Q7.G ; also sheet 4
CH4S: Q8.D ; also sheet 4
PGND: J4.1 J4.4 J5.1 J5.4 ; also sheet 2,4
SGND: J4.9 J4.12 J5.9 J5.12 ; also sheet 1,2,3,4
TP1_OUT: J4.3 J4.6 J5.3 J5.6 ; also sheet 1,3
VOUTA [vout1a2ozcu]: Q1.D Q3.D Q5.D Q7.D ; also sheet 2,4
Unconnected: J4.2 J4.5 J5.2 J5.5

### Notes on the sheet
- To Upper Thruster PCB
  Ch. 1/2
- To Lower Thruster PCB
  Ch. 3/4
- See Note 2 | See Note 2
- See Note 2 | See Note 2
- PD - Power Distribution Section
  Part 2/2
- (c) Samudra Haque, The George Washington University, 2014. All Rights Reserved.

## Library data of the parts
C1 C5 = gwu_mpnl_ucat_v8:OSCON-50SVPF
C2 = gwu_mpnl_ucat_v8:AVX-LD105C475KAB2A
C3 C4 = rcl:C-US: CAPACITOR, American symbol
H1-H3 HBL = mpnl_holes:MOUNT-PAD-ROUND: MOUNTING PAD, round
J1 = gwu_mpnl_ucat_v8:CSK-BUS-CONN: Cubesat Kit Bus Connector 2 x Samtec ESQ-126-39-G-D Connectors 104 pins per Cubesat Kit Bus Spec A5
J2 = gwu_mpnl_ucat_v8:M80-6810642
J3 = gwu_mpnl_ucat_v8:AMPMODU-5-146131-X(5X2)
J4 J5 = gwu_mpnl_ucat_v8:M80-6811242
L1 = gwu_mpnl_ucat_v8:MSS1038
L2 = gwu_mpnl_ucat_v8:MSS1048
L3 = gwu_mpnl_ucat_v8:ELL-5PS100M; MF: PANASONIC; MPN: ELL5PS100M; OC_FARNELL: 1717452
OK1-OK3 = gwu_mpnl_ucat_v8:PS2501L-4
Q1-Q8 = gwu_mpnl_ucat_v8:SI5404BDC
R1 R2 R31-R34 = rcl:R-US_: RESISTOR, American symbol
R3-R30 = resistor:R-US_: RESISTOR, American symbol
SJ1-SJ4 = jumper:SJ: SMD solder JUMPER
U1 = gwu_mpnl_ucat_v8:LTM4609MPV#PBF: Per LTC Datasheet 4609fe LTM4609 (c) Samudra Haque, N3RDX, 2/23/2014
U2 = gwu_mpnl_ucat_v8:UCAT-4CU-B-CONTROL-UNIT
U3 U4 = gwu_mpnl_ucat_v8:LT1161

## Net classes
0 default: clearance 0.205 mm
1 vout1a2ozcu: width 0.406 mm
2 vin2a2ozcu: width 0.889 mm